# EAGLE design SB_TS_2.00 (EAGLE 6.2)
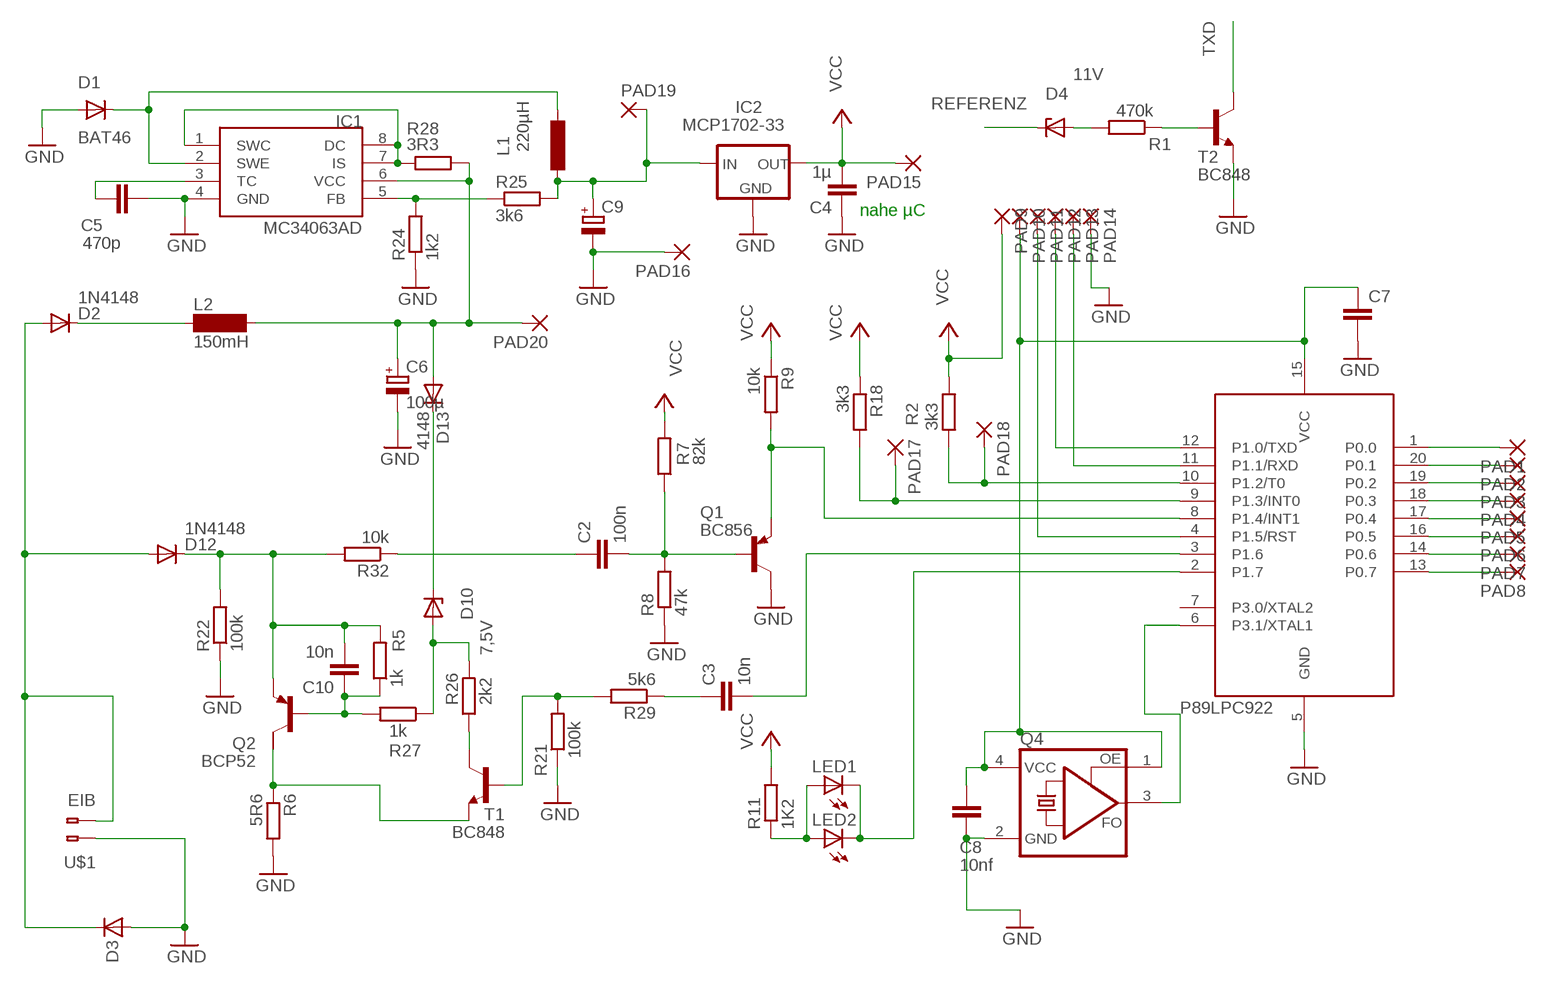
[diagram p0: schematic, sheet 1]

## Parts
C2  100n  C-EUC1206  [C1206]
C3  10n  C-EUC1206  [C1206]
C4  1µ  C-EUC1206  [C1206]
C5  470p  C-EUC1206  [C1206]
C6  100µ  CPOL-EUSANYO_SMD_C6  [SANYO-OSCON_SMD_C6]
C7  C-EUC1206  [C1206]
C8  10nf  C-EUC1206  [C1206]
C9  CPOL-EUE2.5-5  [E2,5-5]
C10  10n  C-EUC1206  [C1206]
D1  BAT46  DIODE-MINIMELF  [MINIMELF]
D2  1N4148  DIODE-MINIMELF  [MINIMELF]
D3  SMAJ40AC  D-SMB  [SMB]
D4  11V  ZPD  [MINIMELF]
D10  7,5V  ZPD  [MINIMELF]
D12  1N4148  DIODE-MINIMELF  [MINIMELF]
D13  4148  DIODE-MINIMELF  [MINIMELF]
IC1  MC34063AD  [SOIC8]
IC2  MCP1702-33  79LXX  [79LXX]
IC3  LPC922FDH  [TSSOP20]
L1  220µH  L-EU2200-11.43  [2200-11.43]
L2  150mH  SD12-1000  [SD12_1000]
LED1  LEDCHIPLED_1206  [CHIPLED_1206]
LED2  LED3MM  [LED3MM]
PAD1  SMD2  [SMD1,27-2,54]
PAD2  SMD2  [SMD1,27-2,54]
PAD3  SMD2  [SMD1,27-2,54]
PAD4  SMD2  [SMD1,27-2,54]
PAD5  SMD2  [SMD1,27-2,54]
PAD6  SMD2  [SMD1,27-2,54]
PAD7  SMD2  [SMD1,27-2,54]
PAD8  SMD2  [SMD1,27-2,54]
PAD9  SMD2  [SMD1,27-2,54]
PAD10  SMD2  [SMD1,27-2,54]
PAD11  SMD2  [SMD1,27-2,54]
PAD12  SMD2  [SMD1,27-2,54]
PAD13  SMD2  [SMD1,27-2,54]
PAD14  SMD2  [SMD1,27-2,54]
PAD15  SMD2  [SMD1,27-2,54]
PAD16  SMD2  [SMD1,27-2,54]
PAD17  SMD2  [SMD1,27-2,54]
PAD18  SMD2  [SMD1,27-2,54]
PAD19  SMD2  [SMD1,27-2,54]
PAD20  SMD2  [SMD1,27-2,54]
Q1  BC856  BC856ALT1SMD  [SOT23-BEC]
Q2  BCP52  FZT753SMD  [SOT223]
Q4  ASFL  [ASF]
R1  470k  R-EU_R1206  [R1206]
R2  3k3  R-EU_M1206  [M1206]
R5  1k  R-EU_R1206  [R1206]
R6  5R6  R-EU_R1206  [R1206]
R7  82k  R-EU_R1206  [R1206]
R8  47k  R-EU_M1206  [M1206]
R9  10k  R-EU_R1206  [R1206]
R11  1K2  R-EU_R1206  [R1206]
R18  3k3  R-EU_R1206  [R1206]
R21  100k  R-EU_R1206  [R1206]
R22  100k  R-EU_M1206  [M1206]
R24  1k2  R-EU_R1206  [R1206]
R25  3k6  R-EU_M1206  [M1206]
R26  2k2  R-EU_M1206  [M1206]
R27  1k  R-EU_R1206  [R1206]
R28  3R3  R-EU_M1206  [M1206]
R29  5k6  R-EU_R1206  [R1206]
R32  10k  R-EU_R1206  [R1206]
T1  BC848  [SOT23]
T2  BC848  [SOT23]
U$1  EIB  [BUSKLEMME243-724]

## Nets
A_PUNKT_EIBIN: C2.2 Q1.B R7.1 R8.2
BASE_SEND: R21.2 R29.2 T1.1(B)
BASE_SEND_AMP: C10.1 Q2.1(B) R5.1 R27.2
C_T1: R26.1 T1.3(C)
CURR_SENSE: Q2.2(C) R6.1 T1.2(E)
EIB+: D2.A D3.1(C) D12.A U$1.2(B-2)
EIB_DC1: C6.+ D13.A IC1.6(VCC) L2.2 PAD20.1(P) R28.2
EIB_SEND: C3.2 IC3.3(P1.6)
EIBIN: IC3.8(P1.4/INT1) Q1.E R9.2
GND: C4.1 C5.2 C6.- C7.2 C8.2 C9.- D1.A D3.2(A) IC1.4(GND) IC2.GND IC3.5(GND) PAD14.1(P) PAD16.1(P) Q1.C Q4.2(GND) R6.2 R8.1 R21.1 R22.1 R24.1 T2.2(E) U$1.1(B-1)
INT0: IC3.9(P1.3/INT0) PAD17.1(P) R18.2
N$1: D4.A R1.2
N$2: C3.1 R29.1
N$3: R1.1 T2.1(B)
N$5: C10.2 D12.C Q2.3(E) R5.2 R22.2 R32.2
N$8: D2.C L2.1
N$19: LED1.A LED2.A R11.1
N$51: D1.C IC1.2(SWE) L1.2
N$52: C5.1 IC1.3(TC)
N$58: D10.C D13.C
N$63: IC1.1(SWC) IC1.7(IS) IC1.8(DC) R28.1
N$77: C2.1 R32.1
OSCCLK: IC3.6(P3.1/XTAL1) Q4.3(FO)
P00: IC3.1(P0.0) PAD1.1(P)
P01: IC3.20(P0.1) PAD2.1(P)
P02: IC3.19(P0.2) PAD3.1(P)
P03: IC3.18(P0.3) PAD4.1(P)
P04: IC3.17(P0.4) PAD5.1(P)
P05: IC3.16(P0.5) PAD6.1(P)
P06: IC3.14(P0.6) PAD7.1(P)
P07: IC3.13(P0.7) PAD8.1(P)
PROG: IC3.2(P1.7) LED1.C LED2.K(C)
PWM: IC3.10(P1.2/T0) PAD18.1(P) R2.2
REFERENZ: D4.C D10.A R26.2 R27.1
RESET: IC3.4(P1.5/RST) PAD11.1(P)
RXD: IC3.11(P1.1/RXD) PAD13.1(P)
TXD: IC3.12(P1.0/TXD) PAD12.1(P) T2.3(C)
VCC: C4.2 IC2.OUT PAD9.1(P) PAD15.1(P) R2.1 R7.2 R9.1 R11.2 R18.1
VCC5V: C9.+ IC2.IN L1.1 PAD19.1(P) R25.2
VCC_FEEDBACK: IC1.5(FB) R24.2 R25.1
VCC_LPC: C7.1 C8.1 IC3.15(VCC) PAD10.1(P) Q4.1(OE) Q4.4(VCC)
Unconnected: IC3.7(P3.0/XTAL2) Q2.4(C/)

## Notes on the sheet
- nahe µC
- P89LPC922

## Library data of the parts
C2-C5 C7 C8 C10 = rcl:C-EU: CAPACITOR, European symbol
C6 C9 = rcl:CPOL-EU: POLARIZED CAPACITOR, European symbol
D1 D2 D12 D13 = diode:DIODE-: DIODE
D3 = semicon-smd-ipc:D-: DIODE unfilled
D4 D10 = diode:ZPD: Z DIODE 500 mW
IC1 = mc34063:MC34063
IC2 = v-reg:79LXX: VOLTAGE REGULATOR
IC3 = LPCGira:LPC922FDH
L1 = rcl:L-EU: INDUCTOR, European symbol
L2 = inductor-neosid:SD12: INDUCTOR nominal inductance
LED1 LED2 = led:LED: LED OSRAM: - CHIPLED LG R971, LG N971, LY N971, LG Q971, LY Q971, LO R971, LY R971 LH N974, LH R974 LS Q976, LO Q976, LY Q976 LO Q996 - Hyper CHIPLED LW Q18S LB Q993, LB Q99A, LB R99A - SideLED LS A670, LO A670, LY A670, LG A670, LP A670 LB A673, LV A673, LT A673, LW A673 LH A674 LY A675 LS A676, LA A676, LO A676, LY A676, LW A676 LS A679, LY A679, LG A679 - Hyper Micro SIDELED® LS Y876, LA Y876, LO Y876, LY Y876 LT Y87S - SmartLED LW L88C, LW L88S LB L89C, LB L89S, LG L890 LS L89K, LO L89K, LY L89K LS L896, LA L896, LO L896, LY L896 - TOPLED LS T670, LO T670, LY T670, LG T670, LP T670 LSG T670, LSP T670, LSY T670, LOP T670, LYG T670 LG T671, LOG T671, LSG T671 LB T673, LV T673, LT T673, LW T673 LH T674 LS T676, LA T676, LO T676, LY T676, LB T676, LH T676, LSB T676, LW T676 LB T67C, LV T67C, LT T67C, LS T67K, LO T67K, LY T67K, LW E67C LS E67B, LA E67B, LO E67B, LY E67B, LB E67C, LV E67C, LT E67C LW T67C LS T679, LY T679, LG T679 LS T770, LO T770, LY T770, LG T770, LP T770 LB T773, LV T773, LT T773, LW T773 LH T774 LS E675, LA E675, LY E675, LS T675 LS T776, LA T776, LO T776, LY T776, LB T776 LHGB T686 LT T68C, LB T68C - Hyper Mini TOPLED® LB M676 - Mini TOPLED Santana® LG M470 LS M47K, LO M47K, LY M47K Source: http://www.osram.convergy.de - LUMILED® LXK2-PW12-R00, LXK2-PW12-S00, LXK2-PW14-U00, LXK2-PW14-V00 LXK2-PM12-R00, LXK2-PM12-S00, LXK2-PM14-U00 LXK2-PE12-Q00, LXK2-PE12-R00, LXK2-PE12-S00, LXK2-PE14-T00, LXK2-PE14-U00 LXK2-PB12-K00, LXK2-PB12-L00, LXK2-PB12-M00, LXK2-PB14-N00, LXK2-PB14-P00, LXK2-PB14-Q00 LXK2-PR12-L00, LXK2-PR12-M00, LXK2-PR14-Q00, LXK2-PR14-R00 LXK2-PD12-Q00, LXK2-PD12-R00, LXK2-PD12-S00 LXK2-PH12-R00, LXK2-PH12-S00 LXK2-PL12-P00, LXK2-PL12-Q00, LXK2-PL12-R00 Source: www.luxeon.com
PAD1-PAD20 = wirepad:SMD2: SMD PAD
Q1 = transistor-pnp:BC856*: PNP Transistror
Q2 = transistor-pnp:FZT753SMD: PNP Transistor
Q4 = crystal:ASF*: CRYSTAL CLOCK OSCILLATORS 5.0 Vdc or 3.3 Vdc - LOW PROFILE ULTRA MINIATURE CERAMIC SURFACE MOUNT Source: http://www.abracon.com/Oscillators/asf1-L-L1.pdf
R1 R2 R5-R9 R11 R18 R21 R22 R24-R29 R32 = rcl:R-EU_: RESISTOR, European symbol
T1 T2 = transistor:BC848: NPN TRANSISTOR
U$1 = con-wago:EIB

## Board
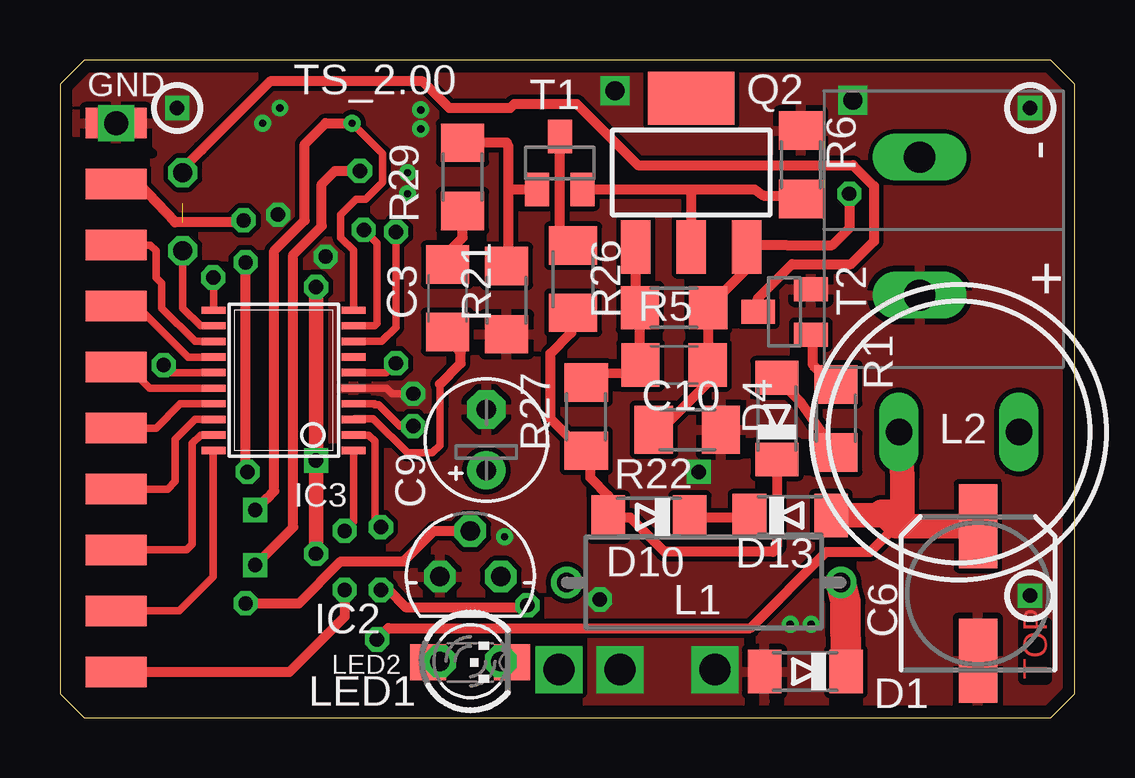
[diagram p1: board, top side]
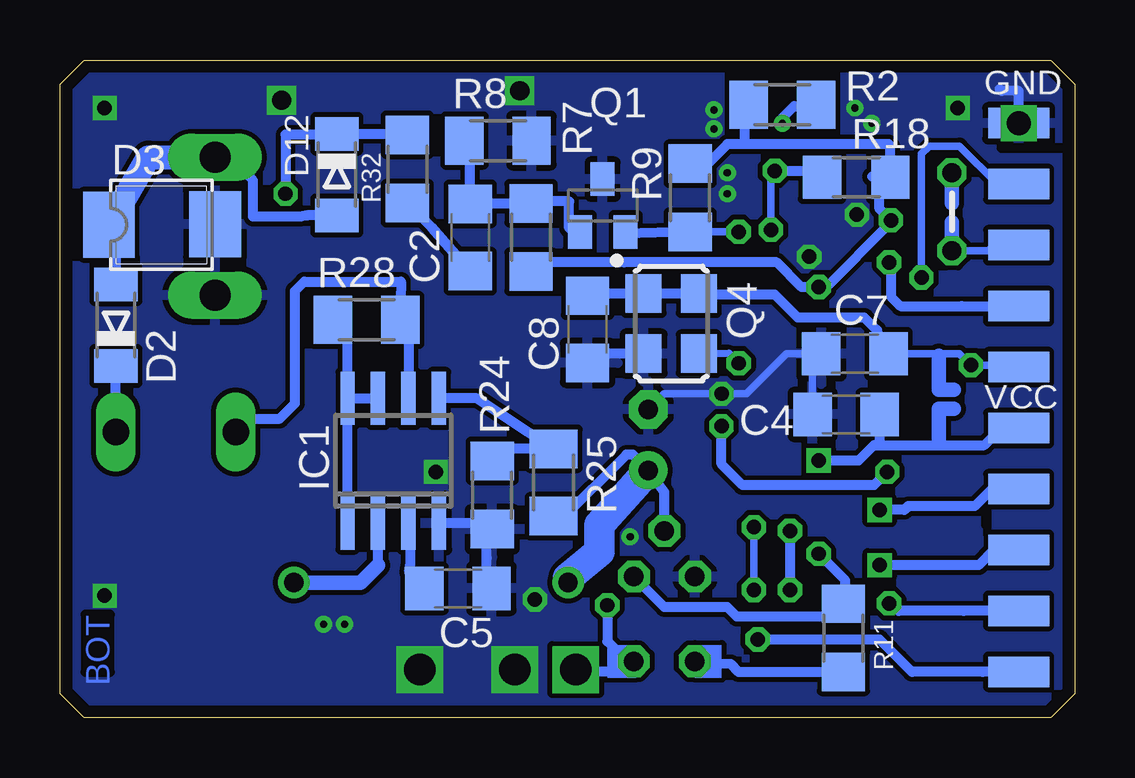
[diagram p2: board, bottom side, seen from below]

Size 42.3 x 27.4 mm. Coordinates in mm from the lower left corner, seen from the top.
Outline: 1,0 41.3,0 42.3,1 42.3,26.4 41.3,27.4 1,27.4 0,26.4 0,1 1,0
Copper layers (1*16): Top 0.035mm / dielectric 1.5mm / Bottom 0.035mm
Design rules "default": minimum track width 10mil, minimum drill 0.6mm, track to track 8mil, track to pad 8mil, pad to pad 8mil, via to via 8mil, smd to smd 8mil, copper to edge 20mil, drill to drill 8mil, minimum pad ring 10mil, minimum via ring 8mil, stop-mask expansion 4mil, vias tented up to drill 20mil, thermal gap 10mil
tRestrict: 2 lines
bRestrict: 2 lines

### Footprints (pad centres in the part's own frame; a part is rotated, then mirrored left to right if it is on the bottom)
C1206 = smd 1.6 x 1.8: 1 -1.4,0; 2 1.4,0
SANYO-OSCON_SMD_C6 = smd 3.5 x 1.6: + 2.8,0; - -2.8,0
E2,5-5 = drill 0.813 pad 1.6: + -1.27,0 | drill 0.813 pad 1.6 octagon: - 1.27,0
MINIMELF = smd 1.4 x 1.8: A 1.7,0; C -1.7,0
SMB = smd 2.159 x 2.743: 1 -2.311,-0.127; 2 2.108,-0.102
SOIC8 = smd 0.6 x 2.2: 1 -1.905,-2.6; 2 -0.635,-2.6; 3 0.635,-2.6; 4 1.905,-2.6; 5 1.905,2.6; 6 0.635,2.6; 7 -0.635,2.6; 8 -1.905,2.6
79LXX = drill 0.813 octagon: GND -1.27,0; IN 0,1.905; OUT 1.27,0
TSSOP20 = smd 0.305 x 0.991: 1 -2.925,-2.918; 2 -2.275,-2.918; 3 -1.625,-2.918; 4 -0.975,-2.918; 5 -0.325,-2.918; 6 0.325,-2.918; 7 0.975,-2.918; 8 1.625,-2.918; 9 2.275,-2.918; 10 2.925,-2.918; 11 2.925,2.918; 12 2.275,2.918; 13 1.625,2.918; 14 0.975,2.918; 15 0.325,2.918; 16 -0.325,2.918; 17 -0.975,2.918; 18 -1.625,2.918; 19 -2.275,2.918; 20 -2.925,2.918
2200-11.43 = drill 0.8 pad 1.27: 1 -5.715,0; 2 5.715,0
SD12_1000 = drill 1.1 long: 1 -2.5,0; 2 2.5,0
CHIPLED_1206 = smd 1.5 x 1.5: A 0,-1.75; C 0,1.75
LED3MM = drill 0.813 octagon: A -1.27,0; K 1.27,0
SMD1,27-2,54 = smd 1.27 x 2.54: 1 0,0
SOT23-BEC = smd 1 x 1.4: B -0.95,-1.1; C 0,1.1; E 0.95,-1.1
SOT223 = smd 1.219 x 2.235: 1 -2.311,-3.099; 2 0,-3.099; 3 2.311,-3.099 | smd 3.6 x 2.2: 4 0,3.099
ASF = smd 1.6 x 1.5: 1 -1.25,-1.15; 2 1.25,-1.15; 3 1.25,1.15; 4 -1.25,1.15
R1206 = smd 1.6 x 1.803: 1 -1.422,0; 2 1.422,0
M1206 = smd 1.6 x 2: 1 -1.4,0; 2 1.4,0
SOT23 = smd 1 x 1.4: 1 -0.95,-1.1; 2 0.95,-1.1; 3 0,1.1
BUSKLEMME243-724 = drill 1.3 long: 1 -2.875,0; 2 2.875,0

### Placement (x,y rotation side)
C2  25.2,20 90 bottom
C3  16.15,17.47 270 top
C4  9.53,12.63 0 bottom
C5  25.71,5.38 0 bottom
C6  38.26,5.17 90 top
C7  9.17,15.16 180 bottom
C8  20.31,16.18 270 bottom
C9  17.77,11.57 90 top
C10  25.6,14.7 0 top
D1  31.07,1.92 180 top
D2  39.96,16.35 90 bottom
D3  37.95,20.66 0 bottom
D4  29.88,12.46 90 top
D10  24.55,8.36 180 top
D12  30.76,22.62 270 bottom
D13  30.44,8.42 0 top
IC1  28.41,10.7 0 bottom
IC2  17.1,5.87 0 top
IC3  9.33,14.05 90 top
L1  26.84,5.63 0 top
L2  37.47,11.9 180 top
LED1  17.1,2.3 270 top
LED2  17.11,2.35 0 top
PAD1  2.34,1.91 90 top
PAD2  2.34,4.45 90 top
PAD3  2.34,6.99 90 top
PAD4  2.34,9.53 90 top
PAD5  2.34,12.06 90 top
PAD6  2.34,14.61 90 top
PAD7  2.34,17.14 90 top
PAD8  2.34,19.68 90 top
PAD9  2.34,12.06 90 bottom
PAD10  2.34,14.61 270 bottom
PAD11  2.34,17.14 270 bottom
PAD12  2.34,19.68 270 bottom
PAD13  2.34,22.23 90 bottom
PAD14  2.34,24.77 270 bottom
PAD15  2.34,22.23 90 top
PAD16  2.34,24.77 90 top
PAD17  2.34,6.99 90 bottom
PAD18  2.34,9.53 270 bottom
PAD19  2.34,4.45 270 bottom
PAD20  2.34,1.91 90 bottom
Q1  19.68,21.34 0 bottom
Q2  26.31,22.71 0 top
Q4  16.82,16.42 270 bottom
R1  32.34,12.46 270 top
R2  12.18,25.54 0 bottom
R5  25.6,17.08 0 top
R6  30.88,23.04 90 top
R7  22.66,20 270 bottom
R8  24.04,24.04 180 bottom
R9  16.03,21.66 270 bottom
R11  9.65,3.32 90 bottom
R18  9.11,22.52 180 bottom
R21  18.61,17.39 90 top
R22  26.15,12 180 top
R24  24.28,9.27 90 bottom
R25  21.72,9.8 270 bottom
R26  21.39,18.27 270 top
R27  21.93,12.54 90 top
R28  29.52,16.58 0 bottom
R29  16.79,22.53 90 top
R32  27.82,22.86 90 bottom
T1  20.84,23.11 0 top
T2  30.2,16.91 90 top
U$1  35.84,20.48 90 top

### Tracks (layer width: path | path; a pad name or v marks a point on that pad's centre or on a via)
A_PUNKT_EIBIN
  Bottom 0.406: R8.2 25.27,23.89 24.96,23.73 25.2,23.5 C2.2 22.8,21.4 R7.1 22.66,21.51 21.07,21.51 21.07,20.4 Q1.B
BASE_SEND
  Top 0.406: R29.2 18.63,23.95 18.69,23.81 18.69,22.07 | 18.69,22.07 18.69,18.89 R21.2 | T1.1 18.75,22.01 18.69,22.07
BASE_SEND_AMP
  Top 0.406: Q2.1 24,16.86 R5.1 24.18,14.32 | 24.18,14.32 C10.1 | 24.18,14.32 22.58,14.37 R27.2
C_T1
  Top 0.406: 21.23,19.59 R26.1 20.84,20.22 T1.3
CURR_SENSE
  Top 0.406: T1.2 26.39,22.01 | Q2.2 26.31,21.93 26.39,22.01 | 26.39,22.01 28.95,22.01 29.33,21.75 30.99,21.75 R6.1
EIB+
  Bottom 0.406: D12.A 31.99,20.92 32.26,20.88 34.25,20.88 34.25,22.38 35.12,23.26 U$1.2 | D2.A 39.96,20.53 D3.1
  Bottom 1.016: D3.1 38.61,23.34 U$1.2
EIB_DC1  (via drill 0.6)
  Top 0.305: v13.21,3.25
  Top 0.406: v13.21,3.25 13.69,3.73 28.77,3.73 31.95,6.91 33.78,6.91 34.85,7.97
  Top 1.016: L2.2 35.12,10.08 35.12,8.57 34.25,8.57 | D13.A 34.1,8.43 34.25,8.57 | 37.82,7.94 C6.+ 34.85,7.97 34.25,8.57
  Bottom 0.406: IC1.6 27.77,16.31 R28.2 28.12,16.6 28.09,18.16 32.12,18.16 32.5,17.78 32.5,13.1 33.14,12.46 34.27,12.46 L2.2 | PAD20.1 2.97,1.91 3.85,1.91 6.79,1.91 7.34,2.46 7.74,2.86 8.13,3.25 v13.21,3.25
EIB_SEND
  Top 0.305: 15.83,13.89 15.83,12.94 | IC3.3 12.28,12.46 13.06,12.46 14.48,11.03 15.52,11.03 15.83,11.35 15.83,12.94 | 15.83,12.94
  Top 0.406: 15.83,13.89 16.71,14.76 16.71,15.2 C3.2
EIBIN  (via drill 0.6)
  Top 0.305: IC3.8 13.41,15.67 14.01,16.27 v14.01,20.24
  Bottom 0.305: v14.01,20.24 R9.2
  Bottom 0.406: R9.2 18.81,20.16 Q1.E
GND  (via drill 0.3, 0.6, 0.8, 1, 1.3)
  Top 0.305: v14.72,13.49 13.85,13.49 13.61,13.73 12.41,13.73 IC3.5
  Top 0.406: R21.1 19.17,16.13
  Bottom 0.305: C4.1 10.93,14.8 C7.2 12.02,15.16 13.69,13.49 v14.72,13.49 17.12,13.49 C9.-
  Bottom 0.406: C5.2 24.55,5.75 24.52,6.65 24.52,7.93 R24.1 | IC1.4 24.53,8.1 R24.1 | R24.1 24.13,8.32 | PAD16.1 2.34,26.11 3.05,26.11 3.13,26.19 | 17.55,12.62 C9.- | Q4.2 20.08,15.17 C8.2
  other vias: 2.34,24.77 27.3,2 23.34,2 9.09,20.95 11.07,19.21 33.06,25.72 26.63,10.24 23.14,26.11 22.5,4.92 4.88,25.4 40.44,25.4 40.44,5.08 14.48,21.83 14.48,22.7 30.44,3.89 31.31,3.89 15.04,25.32 15.04,24.53 9.17,25.4 8.45,24.77 18.53,7.54
  pour Bottom: -1.15,28.1 42.58,28.1 42.82,27.94 42.82,-0.16 42.42,-0.48 -0.44,-0.48 -0.52,-0.4 -0.52,10.56 -0.83,10.87
  pour Top: -0.52,-0.79 -0.52,28.34 42.66,28.34 42.66,-0.71 3.21,-0.71
INT0  (via drill 0.6)
  Top 0.305: IC3.9 13.11,16.32 13.21,16.43 13.21,19.76 v12.66,20.32
  Top 0.406: v8.13,6.35 9.72,7.94 9.72,19.29 10.91,20.48 10.91,22.23 11.47,22.78 v12.5,22.78
  Bottom 0.305: v12.66,20.32 12.66,22.62 v12.5,22.78
  Bottom 0.406: 11.19,22.78 R18.2 11.11,22.78 v12.5,22.78 | v8.13,6.35 4.01,6.35 3.37,6.99 PAD17.1
N$1
  Top 0.406: D4.A 30.84,13.18 R1.2
N$2
  Top 0.406: C3.1 16.39,19.61 16.79,20 16.79,21.27 R29.1
N$3
  Top 0.406: R1.1 31.39,14.68 31.39,15.87 T2.1
N$4
  Bottom 0.61: 5.67,15.08 5.67,13.65 5.04,13.65
N$5  (via drill 0.6)
  Top 0.406: R5.2 27.03,16.67 27.03,14.33 C10.2 27.08,14.02 24.8,11.75 24.8,11.97 R22.2 | R5.2 27.51,16.68 27.52,16.67 | v32.9,21.83 32.9,20.4 32.19,19.68 30.28,19.68 30.2,19.68 28.61,19.68 Q2.3 28.62,18.68 R5.2
  Bottom 0.406: R32.2 27.82,24.53 27.93,24.32 D12.C 30.79,24.29 32.9,24.29 v32.9,21.83
N$6
  Bottom 0.61: 5.04,12.86 5.67,12.86 5.67,11.51
N$8
  Bottom 0.406: L2.1 39.97,14.65 D2.C
N$19
  Top 0.305: LED1.A 15.79,2.3 LED2.A
  Bottom 0.406: LED2.A 15.56,2.26 14.34,2.23 14.02,1.9 R11.1
N$51
  Top 1.27: D1.C 32.74,4.84 L1.2
  Bottom 0.406: 29.04,6.36 IC1.2
  Bottom 0.61: 29.04,6.36 29.77,5.63 L1.2
N$52
  Bottom 0.406: C5.1 27.74,6.05 27.69,6.42 27.69,8.02 IC1.3
N$58
  Top 0.406: 28.67,8.36 D13.C 28.65,8.33 26.28,8.33 D10.C
N$63
  Bottom 0.406: IC1.8 30.31,15.89 R28.1 | IC1.8 IC1.7 | IC1.1 IC1.8
N$77
  Bottom 0.406: C2.1 26.81,20.43 R32.1
OSCCLK  (via drill 0.6)
  Top 0.305: IC3.6 13.6,14.37 v14.01,14.76
  Bottom 0.305: v14.01,14.76 14.41,15.17 Q4.3
  Bottom 0.406: Q4.3
P00  (via drill 0.6)
  Top 0.305: IC3.1 12.24,8.16 v11.87,7.78
  Top 0.406: PAD1.1 3.13,1.91 9.56,1.91 11.87,4.21 v11.87,5.32
  Bottom 0.406: v11.87,7.78 v11.87,5.32
P01
  Top 0.305: IC3.20 6.39,11.12 6.39,5.87 4.96,4.45 3.42,4.45
  Top 0.406: PAD2.1 3.42,4.45
P02
  Top 0.305: IC3.19 5.86,11.77 5.51,11.43 5.51,7.22 5.28,6.99 3.42,6.99
  Top 0.406: PAD3.1 3.42,6.99
P03
  Top 0.305: IC3.18 5.64,12.42 4.8,11.59 4.8,9.84 4.48,9.53 3.42,9.53
  Top 0.406: PAD4.1 3.42,9.53
P04
  Top 0.305: IC3.17 5.02,13.07 4.01,12.06 3.42,12.06
  Top 0.406: PAD5.1 3.42,12.06
P05
  Top 0.305: IC3.16 3.75,13.72 2.87,14.61
  Top 0.406: PAD6.1 2.87,14.61
P06
  Top 0.305: IC3.14 5.33,15.02 3.21,17.14 3.05,17.14 2.7,17.5
  Top 0.406: PAD7.1 2.7,17.5
P07
  Top 0.305: IC3.13 5.64,15.67 4.25,17.07 4.25,18.1 4.01,18.34 4.01,19.45 3.77,19.68 PAD8.1
PROG  (via drill 0.6, 1.3)
  Top 0.305: IC3.2 12.87,11.77 13.14,11.51 13.14,8.18 v13.37,7.94 | v13.37,5.32 13.69,5.32 | LED1.C 18.43,2.3 LED2.K
  Top 0.406: 13.69,5.32 14.41,4.6 19.65,4.61 v19.48,4.68
  Bottom 0.305: v13.37,7.94 v13.37,5.32
  Bottom 0.406: v20.8,2 20.71,1.91 18.74,1.91 LED2.K 18.43,2.3 18.62,2.3 19.48,3.17 v19.48,4.68
PWM  (via drill 0.3, 0.6)
  Top 0.305: IC3.10 12.24,19.47 11.71,20 11.71,20.95 12.34,21.59 12.74,21.59 13.45,22.3 13.45,23.5 v12.18,24.77
  Top 0.406: v8.13,8.65 8.61,9.13 8.93,9.45 8.93,19.45 10.2,20.72 10.2,23.89 11.07,24.77 v12.18,24.77
  Bottom 0.406: PAD18.1 3.45,9.53 4.17,8.81 6.94,8.81 7.1,8.65 v8.13,8.65 | v12.18,24.77 12.18,25 11.71,25.48 10.84,25.48 R2.2
REFERENZ
  Top 0.406: R26.2 21.31,16.79 21.31,16.03 20.44,15.16 20.44,12.46 21.78,11.12 R27.1 22.1,11.11 22.1,10 22.85,9.25 D10.A 22.88,8.33 23.77,8.33 25.2,6.91 29.72,6.91 29.88,7.14 D4.C
RESET  (via drill 0.6)
  Top 0.305: IC3.4 13.11,13.07 13.11,13.04 13.27,13.04 14.17,12.14 v14.72,12.14
  Top 0.406: v7.74,18.97 7.74,10.4 v7.82,10.24
  Bottom 0.406: PAD11.1 3.37,17.14 4.72,17.14 7.26,17.14 7.66,17.54 7.66,18.97 v7.74,18.97 | v7.82,10.24 7.98,10.08 8.37,9.68 13.85,9.68 14.72,10.56 v14.72,12.14
RXD  (via drill 0.6)
  Top 0.305: IC3.11 6.41,18.48 v6.39,18.34
  Bottom 0.305: v6.39,18.34 6.39,23.5 6.07,23.81 4.8,23.81 3.21,22.23 PAD13.1
  Bottom 0.406: PAD13.1 2.42,22.23
TXD  (via drill 0.8)  (1 unrouted)
  Top 0.305: IC3.12 5.86,16.32 5.12,17.07 v5.12,19.45
  Top 0.406: v5.12,22.7 5.12,22.86 5.91,23.65 8.77,26.51 15.12,26.51 16.23,25.4 18.77,25.4 18.93,25.56 21.55,25.56 24.09,23.02 33.06,23.02 33.93,22.15 33.93,19.84 32.98,18.89 30.52,18.89 29.1,17.47 T2.3
  Bottom 0.305: v5.12,19.45 3.61,19.45 3.45,19.61 2.42,19.61 PAD12.1
  Bottom 0.406: PAD12.1 2.42,19.68
  Bottom 0.61: v5.12,22.7 5.12,21.43 | v5.12,19.45 5.12,20.64
VCC  (via drill 0.6)
  Top 0.406: v7.66,20.72 7.58,20.64 4.8,20.64 3.29,22.23 PAD15.1
  Top 0.61: v10.67,10.72 v10.67,17.94 | v10.67,6.83 v10.67,10.72 | v10.67,10.72 10.67,10.79
  Bottom 0.406: 13.77,23.89 7.77,23.89 7.69,23.81 R18.1 8.13,22.57 | 13.77,23.89 14.48,23.89 15.44,22.94 15.97,22.94 R9.1 | 8.13,22.57 8.45,22.54 | PAD9.1 3.05,12.06 3.77,11.35 8.21,11.35 | IC2.OUT 17.1,4.6 15.2,4.6 14.48,4.6 14.09,4.21 10.44,4.21 9.96,4.45 9.95,4.45 R11.2 9.56,4.83 9.56,5.71 v10.67,6.83 10.36,6.91 | C4.2 8.13,11.44 8.21,11.35 | 8.21,11.35 8.37,11.35 9.01,10.72 v10.67,10.72 | 8.13,22.57 8.13,21.19 v7.66,20.72 | v7.66,20.72 7.74,20.56 10.36,17.94 v10.67,17.94 10.99,17.94 11.39,17.94 12.42,18.97 18.77,18.97 19.01,18.97 22.42,18.97 22.66,18.73 22.58,18.66 R7.2 | v7.66,20.72 | R2.1 13.77,25.54 13.77,23.89
VCC5V  (via drill 0.6)
  Top 0.406: IC2.IN 16.39,7.78 15.6,7.78 14.33,6.51 11.71,6.51 9.96,4.76 v7.74,4.76
  Bottom 0.406: IC2.IN 17.1,9.4 C9.+ 18.42,10.95 18.69,10.95 21.49,8.16 R25.2 | PAD19.1 3.29,4.45 4.64,4.45 7.34,4.45 v7.74,4.76
  Bottom 1.27: L1.1 21.12,5.83 19.8,6.91 19.8,8.04 C9.+
VCC_FEEDBACK
  Bottom 0.406: IC1.5 24.91,13.3 R25.1 24.25,11.2 R24.2
VCC_LPC  (via drill 0.6)
  Top 0.305: IC3.15 4.63,14.37 v4.32,14.68
  Bottom 0.305: 2.9,14.61 3.37,14.68 v4.32,14.68 4.8,15.16 C7.1
  Bottom 0.406: C7.1 8.24,16.14 8.77,16.67 11.55,16.67 12.5,17.62 15.15,17.62 Q4.4 Q4.1 19.92,17.67 C8.1 | PAD10.1 2.9,14.61
(copper drawn outside any net)
  shapes: Bottom area x2

### Text on the board
Top: TOP
Bottom: BOT
tPlace: GND | TS_2.00 | - | +
bPlace: GND | CC | V
tDocu: GND | VCC | P07 | P06 | P05 | P04 | P03 | P02 | P01 | P00
bDocu: GND | RXD | TXD | RES | Vin | VCC | PWM | INT0 | +5V | EIB_DC